# Altium schematic sheet WX sat filter.SchDoc
size A4; SheetNumber: 1; SheetTotal: 1
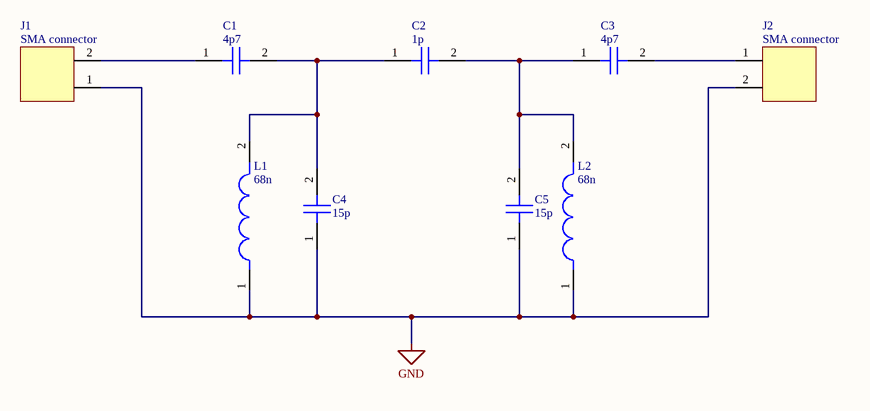
[diagram p0: WX sat filter.SchDoc]

## Parts
C1  4p7  [0603_CAP]
C2  1p  [0603_CAP]
C3  4p7  [0603_CAP]
C4  15p  [0603_CAP]
C5  15p  [0603_CAP]
J1  SMA connector
J2  SMA connector
L1  68n  [0603_CAP]
L2  68n  [0603_CAP]

## Nets
GND: C4.1 C5.1 J1.1 J2.2 L1.1 L2.1
NetC1_1: C1.1 J1.2
NetC1_2: C1.2 C2.1 C4.2 L1.2
NetC2_2: C2.2 C3.1 C5.2 L2.2
NetC3_2: C3.2 J2.1

## Library data of the parts
C1-C5 = CAP_0603_generic: Part Number: *; Manufacturer: *; Supplier: *; Order Code: *
  C1 C3: Value: 4p7
  C2: Value: 1p
  C4 C5: Value: 15p
J1 J2 = HEADER_1x2_0.254MM: Part Number: *; Value: SMA connector; Manufacturer: *; Supplier: *; Order Code: *
L1 L2 = IND_air_0603_generic: Part Number: *; Value: 68n; Manufacturer: *; Supplier: *; Order Code: *